# Altium schematic sheet phim_led.SchDoc
size A
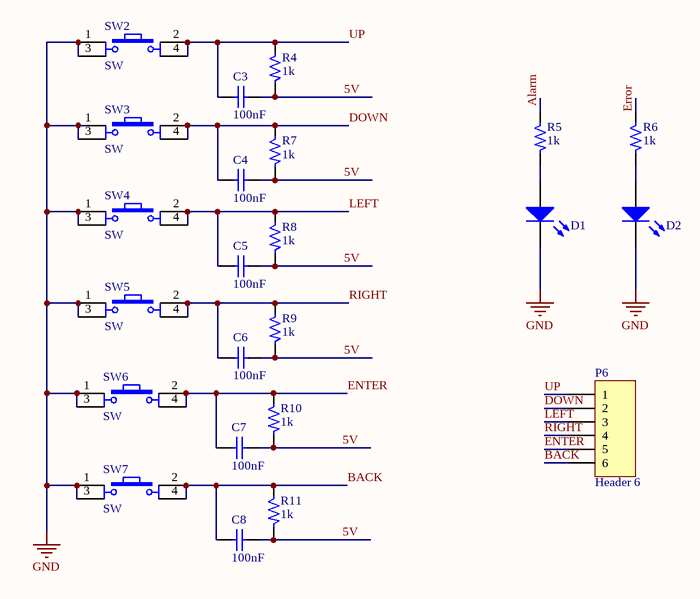
[diagram p0: phim_led.SchDoc]

## Parts
C3  value 100nF  [Tu-pico]  (hidden comment: Capacitor Ceramic)
C4  value 100nF  [Tu-pico]  (hidden comment: Capacitor Ceramic)
C5  value 100nF  [Tu-pico]  (hidden comment: Capacitor Ceramic)
C6  value 100nF  [Tu-pico]  (hidden comment: Capacitor Ceramic)
C7  value 100nF  [Tu-pico]  (hidden comment: Capacitor Ceramic)
C8  value 100nF  [Tu-pico]  (hidden comment: Capacitor Ceramic)
D1  LED  [LED_3mm]  (value not drawn)
D2  LED  [LED_3mm]  (value not drawn)
P6  Header 6  [HDR1X6]
R4  1k  [RES-1/4W]
R5  1k  [RES-1/4W]
R6  1k  [RES-1/4W]
R7  1k  [RES-1/4W]
R8  1k  [RES-1/4W]
R9  1k  [RES-1/4W]
R10  1k  [RES-1/4W]
R11  1k  [RES-1/4W]
SW2  SW  [SW4]
SW3  SW  [SW4]
SW4  SW  [SW4]
SW5  SW  [SW4]
SW6  SW  [SW4]
SW7  SW  [SW4]

## Nets
GND: D1.2(K) D2.2(K) SW2.1 SW2.3 SW3.1 SW3.3 SW4.1 SW4.3 SW5.1 SW5.3 SW6.1 SW6.3 SW7.1 SW7.3
5V: C3.2 C4.2 C5.2 C6.2 C7.2 C8.2 R4.2 R7.2 R8.2 R9.2 R10.2 R11.2
Alarm: R5.1
BACK: C8.1 P6.6 R11.1 SW7.2 SW7.4
DOWN: C4.1 P6.2 R7.1 SW3.2 SW3.4
ENTER: C7.1 P6.5 R10.1 SW6.2 SW6.4
Error: R6.1
LEFT: C5.1 P6.3 R8.1 SW4.2 SW4.4
RIGHT: C6.1 P6.4 R9.1 SW5.2 SW5.4
UP: C3.1 P6.1 R4.1 SW2.2 SW2.4
NetD1_1: D1.1(A) R5.2
NetD2_1: D2.1(A) R6.2

## Library data of the parts
C3-C8 = CapCeramic: Capacitor; Published: 8-Jun-2000; LatestRevisionDate: 17-Jul-2002; LatestRevisionNote: Re-released for DXP Platform.; PackageReference: RAD-0.3; Publisher: Altium Limited
D1 D2 = LED: Typical INFRARED GaAs LED; Published: 8-Jun-2000; LatestRevisionDate: 08-Jul-2005; LatestRevisionNote: Mech Layer 1 removed.; PackageReference: LED-0; Publisher: Altium Limited
P6 = Header 6: Header, 6-Pin; LatestRevisionDate: 17-Jul-2002; LatestRevisionNote: Re-released for DXP Platform.; Publisher: Altium Limited
R4-R11 = R: Resistor 1/4W; Value: R1/4W - 1K
SW2-SW7 = SW4: Switch button 4 pin; Value: Button chip 4 pin